# Altium schematic sheet 05_Power_Digital_Part.SchDoc
size A4; SheetNumber: 5; SheetTotal: 6
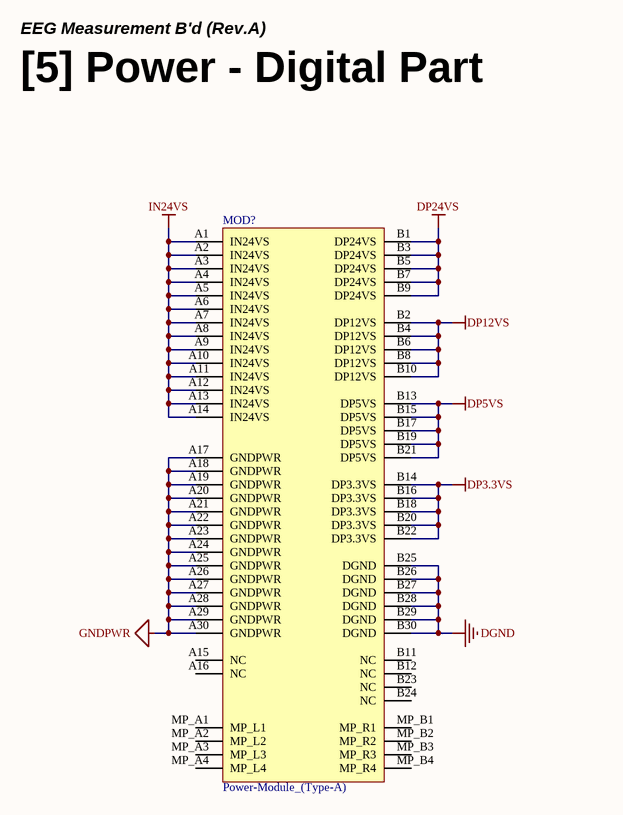
[diagram p0: 05_Power_Digital_Part.SchDoc]

## Parts
MOD?  Power-Module_(Type-A)  [MOD_Power-Module_Type-A]

## Nets
DGND: MOD?.B25(DGND) MOD?.B26(DGND) MOD?.B27(DGND) MOD?.B28(DGND) MOD?.B29(DGND) MOD?.B30(DGND)
DP3.3VS: MOD?.B14(DP3.3VS) MOD?.B16(DP3.3VS) MOD?.B18(DP3.3VS) MOD?.B20(DP3.3VS) MOD?.B22(DP3.3VS)
DP5VS: MOD?.B13(DP5VS) MOD?.B15(DP5VS) MOD?.B17(DP5VS) MOD?.B19(DP5VS) MOD?.B21(DP5VS)
DP12VS: MOD?.B2(DP12VS) MOD?.B4(DP12VS) MOD?.B6(DP12VS) MOD?.B8(DP12VS) MOD?.B10(DP12VS)
DP24VS: MOD?.B1(DP24VS) MOD?.B3(DP24VS) MOD?.B5(DP24VS) MOD?.B7(DP24VS) MOD?.B9(DP24VS)
GNDPWR: MOD?.A17(GNDPWR) MOD?.A18(GNDPWR) MOD?.A19(GNDPWR) MOD?.A20(GNDPWR) MOD?.A21(GNDPWR) MOD?.A22(GNDPWR) MOD?.A23(GNDPWR) MOD?.A24(GNDPWR) MOD?.A25(GNDPWR) MOD?.A26(GNDPWR) MOD?.A27(GNDPWR) MOD?.A28(GNDPWR) MOD?.A29(GNDPWR) MOD?.A30(GNDPWR)
IN24VS: MOD?.A1(IN24VS) MOD?.A2(IN24VS) MOD?.A3(IN24VS) MOD?.A4(IN24VS) MOD?.A5(IN24VS) MOD?.A6(IN24VS) MOD?.A7(IN24VS) MOD?.A8(IN24VS) MOD?.A9(IN24VS) MOD?.A10(IN24VS) MOD?.A11(IN24VS) MOD?.A12(IN24VS) MOD?.A13(IN24VS) MOD?.A14(IN24VS)

Not connected (* = marked no-connect by the designer): MOD? A15(NC) A16(NC) B11(NC) B12(NC) B23(NC) B24(NC) MP_A1(MP_L1) MP_A2(MP_L2) MP_A3(MP_L3) MP_A4(MP_L4) MP_B1(MP_R1) MP_B2(MP_R2) MP_B3(MP_R3) MP_B4(MP_R4)

## Notes on the sheet
- EEG Measurement B'd (Rev.A)
- [5] Power - Digital Part
- Title
- Rev
- Doc
- Sheet #
- of
- Author
- This document is copyright of ArkX and shall not be revealed, produced, copied, in whole or in part,
- Date
- nor used for any purpose other than submitted.

## Library data of the parts
MOD? = MOD_Power-Module_Type-A